# Altium schematic sheet Top Level.SchDoc
size B; SheetNumber: 1; SheetTotal: 8
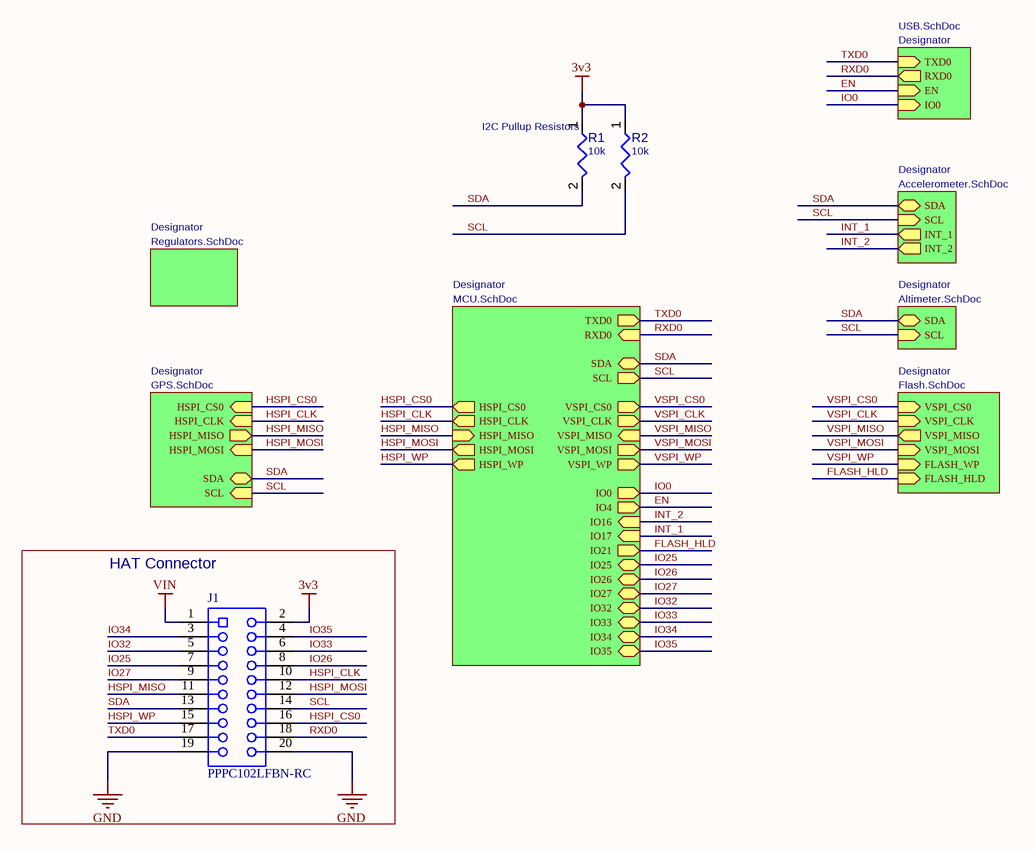
[diagram p0: Top Level.SchDoc]

## Parts
J1  PPPC102LFBN-RC  [SLIN-PPPC102LFBN-RC_V]
R1  value 10k  [RESC0402(1005)_L]  (hidden comment: Resistor 10K  +/-1 % 0402 63 mW)
R2  value 10k  [RESC0402(1005)_L]  (hidden comment: Resistor 10K  +/-1 % 0402 63 mW)

## Blocks framed on the sheet
HAT Connector: J1

## Sub-sheets
Designator = USB.SchDoc: TXD0 (in), RXD0 (out), EN (in), IO0 (in)
Designator = Flash.SchDoc: VSPI_CS0 (in), VSPI_CLK (in), FLASH_HLD (in), VSPI_MISO (out), VSPI_MOSI (in), FLASH_WP (in)
Designator = MCU.SchDoc: TXD0 (out), RXD0 (in), SDA (bidir), SCL (out), VSPI_CS0 (out), VSPI_CLK (out), VSPI_MISO (in), VSPI_MOSI (out), VSPI_WP (out), HSPI_WP (out), HSPI_CLK (out), HSPI_CS0 (out), HSPI_MISO (in), HSPI_MOSI (out), IO0 (out), IO4 (out), IO16 (in), IO17 (in), IO21 (out), IO25 (bidir), IO26 (bidir), IO27 (bidir), IO32 (bidir), IO33 (bidir), IO34 (bidir), IO35 (bidir)
Designator = Accelerometer.SchDoc: SDA (bidir), SCL (in), INT_1 (out), INT_2 (out)
Designator = GPS.SchDoc: HSPI_CS0 (in), HSPI_CLK (in), HSPI_MISO (out), HSPI_MOSI (in), SDA (bidir), SCL (in)
Designator = Altimeter.SchDoc: SDA (bidir), SCL (in)
Designator = Regulators.SchDoc: no entries

## Nets
3v3: J1.2 R1.1 R2.1
GND: J1.19 J1.20
VIN: J1.1
EN: sheet Designator/EN, sheet Designator/IO4
FLASH_HLD: sheet Designator/FLASH_HLD, sheet Designator/IO21
HSPI_CLK: J1.10 ; sheet Designator/HSPI_CLK, sheet Designator/HSPI_CLK
HSPI_CS0: J1.16 ; sheet Designator/HSPI_CS0, sheet Designator/HSPI_CS0
HSPI_MISO: J1.11 ; sheet Designator/HSPI_MISO, sheet Designator/HSPI_MISO
HSPI_MOSI: J1.12 ; sheet Designator/HSPI_MOSI, sheet Designator/HSPI_MOSI
HSPI_WP: J1.15 ; sheet Designator/HSPI_WP
INT_1: sheet Designator/IO17, sheet Designator/INT_1
INT_2: sheet Designator/IO16, sheet Designator/INT_2
IO0: sheet Designator/IO0, sheet Designator/IO0
IO25: J1.7 ; sheet Designator/IO25
IO26: J1.8 ; sheet Designator/IO26
IO27: J1.9 ; sheet Designator/IO27
IO32: J1.5 ; sheet Designator/IO32
IO33: J1.6 ; sheet Designator/IO33
IO34: J1.3 ; sheet Designator/IO34
IO35: J1.4 ; sheet Designator/IO35
RXD0: J1.18 ; sheet Designator/RXD0, sheet Designator/RXD0
SCL: J1.14 R2.2 ; sheet Designator/SCL, sheet Designator/SCL, sheet Designator/SCL, sheet Designator/SCL
SDA: J1.13 R1.2 ; sheet Designator/SDA, sheet Designator/SDA, sheet Designator/SDA, sheet Designator/SDA
TXD0: J1.17 ; sheet Designator/TXD0, sheet Designator/TXD0
VSPI_CLK: sheet Designator/VSPI_CLK, sheet Designator/VSPI_CLK
VSPI_CS0: sheet Designator/VSPI_CS0, sheet Designator/VSPI_CS0
VSPI_MISO: sheet Designator/VSPI_MISO, sheet Designator/VSPI_MISO
VSPI_MOSI: sheet Designator/VSPI_MOSI, sheet Designator/VSPI_MOSI
VSPI_WP: sheet Designator/FLASH_WP, sheet Designator/VSPI_WP

## Notes on the sheet
- (near R1) I2C Pullup Resistors

## Library data of the parts
J1 = CMP-002-00029-1: Female Header, Pitch 2.54 mm, 2 x 10 Position, Height 8.75 mm, Tail Length 3.2 mm, -40 to 105 degC, RoHS, Bulk; Manufacturer: Sullins; Mounting Technology: TH; Gender: Female; Datasheet URL: http://datasheet.octopart.com/PPPC102LFBN-RC-Sullins-datasheet-8327184.pdf; Max Operating Temperature: 105°C; Package Description: Female Header, Pitch 2.54 mm, 2 x 10 Position, Height 8.75 mm, Tail Length 3.2 mm; Min Operating Temperature: -40°C; Datasheet Version: Rev. D, 10/2007; Case/Package: PPPC102LFBN-RC; Connector Type: Header; RoHS Compliant: Unknown; Package Reference: PPPC102LFBN-RC
R1 R2 = CMP-009-00149-2: Chip Resistor, 10 kOhms, +/-1 %, 63 mW, -55 to 125 degC, 0402; Power: 63mW; Tolerance: 1%; Pins: 2; Max Operating Temperature: 155°C; Min Operating Temperature: -55°C; Case/Package: 0402